# Altium project PCB_Project1.PrjPcb
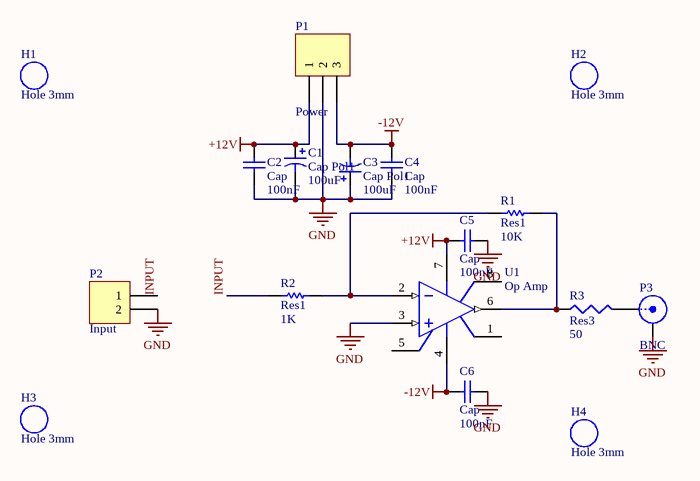
[diagram p0: Sheet2.SchDoc]
1 sheet, 17 parts. Net scope: global (net labels, ports and power ports of the same name join across sheets).
Board file: PCB2.PcbDoc

## Sheet Sheet2.SchDoc
size A

### Parts
C1  Cap Pol1  value 100uF  [RB7.6-15]
C2  Cap  value 100nF  [RAD-0.3]
C3  Cap Pol1  value 100uF  [RB7.6-15]
C4  Cap  value 100nF  [RAD-0.3]
C5  Cap  value 100nF  [RAD-0.3]
C6  Cap  value 100nF  [RAD-0.3]
H1  Hole 3mm  [Hole 3mm]
H2  Hole 3mm  [Hole 3mm]
H3  Hole 3mm  [Hole 3mm]
H4  Hole 3mm  [Hole 3mm]
P1  Power  [HDR1X3H]
P2  Input  [HDR1X2]
P3  BNC  [BNC_RA CON]
R1  Res1  value 10K  [AXIAL-0.3]
R2  Res1  value 1K  [AXIAL-0.3]
R3  Res3  value 50  [J1-0603]
U1  Op Amp  [DIP-8]

### Nets
+12V: C1.1 C2.2 C5.2 P1.1 U1.7(V+)
-12V: C3.2 C4.2 C6.2 P1.3 U1.4(V-)
GND: C1.2 C2.1 C3.1 C4.1 C5.1 C6.1 P1.2 P2.2 P3.2(Y) U1.3(IN+)
INPUT: P2.1 R2.1
NetP3_1: P3.1(X) R3.2
NetR1_1: R1.1 R2.2 U1.2(IN-)
NetR1_2: R1.2 R3.1 U1.6(OUT)

Not connected (* = marked no-connect by the designer): U1 1(OS_NUL) 5(OS_NUL) 8(TAB)

### Library data of the parts
C1 C3 = Cap Pol1: Polarized Capacitor (Radial); Published: 8-Jun-2000; LatestRevisionDate: 17-Jul-2002; LatestRevisionNote: Re-released for DXP Platform.; PackageReference: RB7.6-15; Publisher: Altium Limited; PackageDescription: Polarized Capacitor (Radial); 2 Leads
C2 C4-C6 = Cap: Capacitor; Published: 8-Jun-2000; LatestRevisionDate: 17-Jul-2002; LatestRevisionNote: Re-released for DXP Platform.; PackageReference: RAD-0.3; Publisher: Altium Limited; PackageDescription: Radial Cap, Thru-Hole; 2 Leads; 0.3 in Pin Spacing
P1 = Header 3H: Header, 3-Pin, Right Angle; LatestRevisionDate: 17-Jul-2002; LatestRevisionNote: Re-released for DXP Platform.; Publisher: Altium Limited
P2 = Header 2: Header, 2-Pin; LatestRevisionDate: 17-Jul-2002; LatestRevisionNote: Re-released for DXP Platform.; Publisher: Altium Limited
P3 = BNC: BNC Elbow Connector; LatestRevisionDate: 17-Jul-2002; LatestRevisionNote: Re-released for DXP Platform.; Publisher: Altium Limited
R1 R2 = Res1: Resistor; Published: 8-Jun-2000; LatestRevisionDate: 17-Jul-2002; LatestRevisionNote: Re-released for DXP Platform.; PackageReference: AXIAL-0.3; Publisher: Altium Limited; PackageDescription: Axial Device, Thru-Hole; 2 Leads; 0.3 in Pin Spacing
R3 = Res3: Resistor; Published: 8-Jun-2000; LatestRevisionDate: 29-May-2009; LatestRevisionNote: IPC-7351 Footprint Added.; PackageReference: J1-0603; Publisher: Altium Limited; PackageDescription: Chip Resistor
U1 = Op Amp: FET Operational Amplifier; Published: 8-Jun-2000; LatestRevisionDate: 17-Jul-2002; LatestRevisionNote: Re-released for DXP Platform.; DatasheetVersion: REV. B; PackageVersion: 1990; PackageReference: H-08A; Publisher: Altium Limited; PackageDescription: Can; 8 Leads; Pin Circle Dia. 5.08 mm; Lead Dia. 0.53 mm (max); ComponentLink1Description: Manufacturer Link; ComponentLink1URL: http://www.analog.com/